# Altium project FlightController.PrjPcb
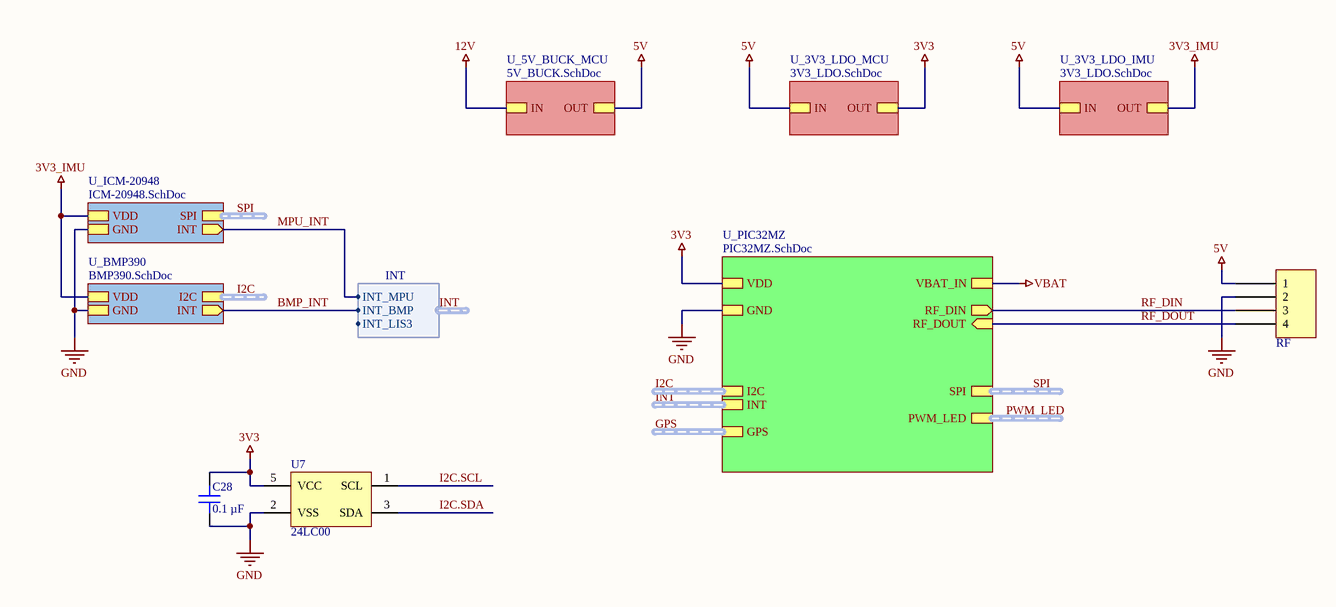
[diagram p0: FlightController.SchDoc]
6 sheets, 42 parts. Net scope: hierarchical (ports join the sheet entries above them; power ports are global).
Board file: FlightController.PcbDoc
Sheets:
  FlightController.SchDoc
    U_PIC32MZ = PIC32MZ.SchDoc
    U_3V3_LDO_MCU = 3V3_LDO.SchDoc
    U_3V3_LDO_IMU = 3V3_LDO.SchDoc
    U_ICM-20948 = ICM-20948.SchDoc
    U_BMP390 = BMP390.SchDoc
    U_5V_BUCK_MCU = 5V_BUCK.SchDoc

## Sheet FlightController.SchDoc
size B; Revision: 6.2; SheetNumber: 1; SheetTotal: 6

### Parts
C28  0.1 µF  [CAP 0402_1005]
RF  SM04B-SRSS-TB(LF)(SN)  [JST SM04B-SRSS-TB]  (value not drawn)
U7  24LC00  [SOT-23-5]

### Sub-sheets
U_3V3_LDO_IMU = 3V3_LDO.SchDoc: OUT, IN
U_3V3_LDO_MCU = 3V3_LDO.SchDoc: OUT, IN
U_5V_BUCK_MCU = 5V_BUCK.SchDoc: OUT, IN
U_BMP390 = BMP390.SchDoc: VDD, GND, I2C (harness I2C), INT (out)
U_ICM-20948 = ICM-20948.SchDoc: VDD, GND, SPI (harness I2C), INT (out)
U_PIC32MZ = PIC32MZ.SchDoc: RF_DIN (out), RF_DOUT (in), GND, VDD, VBAT_IN, I2C (harness I2C), GPS (harness GPS), PWM_LED (harness PWM_LED), INT (harness INT), SPI (harness SPI)

### Harnesses
INT: INT_MPU, INT_BMP, INT_LIS3

### Nets
3V3: C28.2 U7.5(VCC) ; sheet U_PIC32MZ/VDD, sheet U_3V3_LDO_MCU/OUT
3V3_IMU: sheet U_3V3_LDO_IMU/OUT, sheet U_ICM-20948/VDD, sheet U_BMP390/VDD
5V: RF.1 ; sheet U_3V3_LDO_MCU/IN, sheet U_3V3_LDO_IMU/IN, sheet U_5V_BUCK_MCU/OUT
GND: C28.1 RF.2 U7.2(VSS) ; sheet U_PIC32MZ/GND, sheet U_ICM-20948/GND, sheet U_BMP390/GND
BMP_INT: sheet U_BMP390/INT, sheet U_PIC32MZ/INT.INT_BMP
I2C.SCL: U7.1(SCL)
I2C.SDA: U7.3(SDA)
MPU_INT: sheet U_ICM-20948/INT, sheet U_PIC32MZ/INT.INT_MPU  [project net INT.INT_MPU]
RF_DIN: RF.3 ; sheet U_PIC32MZ/RF_DIN
RF_DOUT: RF.4 ; sheet U_PIC32MZ/RF_DOUT

### Buses and harness runs
harness GPS = sheet U_PIC32MZ/GPS
harness I2C = sheet U_BMP390/I2C
harness I2C = sheet U_PIC32MZ/I2C
harness INT = sheet U_PIC32MZ/INT
harness PWM_LED = sheet U_PIC32MZ/PWM_LED
harness SPI = sheet U_ICM-20948/SPI
harness SPI = sheet U_PIC32MZ/SPI

### Library data of the parts
C28 = C0402C104K4RACAUTO: CAP CER 0.1UF 16V X7R 0402; manufacturer: KEMET; Tolerance: ±10%; Part Number: C0402C104K4RACAUTO; Value: 0.1 µF; Applications: Automotive, Bypass, Decoupling; Capacitance: 0.1 µF; componentlink1description: Datasheet; componentlink1url: https://api.kemet.com/component-edge/download/specsheet/C0402C104K4RACAUTO.pdf; componentlink2description: DigiKey Link; componentlink2url: https://www.digikey.com/en/products/detail/kemet/C0402C104K4RACAUTO/3314827; Device Package: 0402 (1005 Metric); lastupdated: 8/14/2022 9:05:51 PM; Lifecycle Status: Active; Minimum Order: 1; Mounting Type: Surface Mount, MLCC; Operating Temperature: -55°C ~ 125°C; Package / Case: 0402 (1005 Metric); packaging: TapeAndReel; partid: 3024; Part Status: Active; price: 0.01; Ratings: AEC-Q200; series: SMD Auto X7R; Size / Dimension: 0.039" L x 0.020" W (1.00mm x 0.50mm); Supplier 1: DigiKey; Supplier Part Number 1: 399-6828-1-ND; Temperature Coefficient: X7R; Thickness (Max): 0.022" (0.55mm); Voltage - Rated: 16V
RF = SM04B-SRSS-TB(LF)(SN): CONN HEADER SMD R/A 4POS 1MM; Manufacturer: JST Sales America Inc.; Current Rating (Amps): 0.7A; Material Flammability Rating: UL94 V-0; Number of Positions: 4; Number of Positions Loaded: All; Pitch - Mating: 0.039" (1.00mm); Shrouding: Shrouded - 4 Wall; Style: Board to Cable/Wire; Voltage Rating: 50V; Part Number: SM04B-SRSS-TB(LF)(SN); ComponentLink1Description: Datasheet; ComponentLink1URL: http://www.jst-mfg.com/product/pdf/eng/eSH.pdf; ComponentLink2Description: DigiKey Link; ComponentLink2URL: http://digikey.com/product-detail/en/jst-sales-america-inc/SM04B-SRSS-TB-LF-SN/455-1804-1-ND/926875; Connector Type: Header; Contact Finish - Mating: Tin; Contact Finish - Post: Tin; Contact Material: Copper Alloy; Contact Shape: Square; Contact Type: Male Pin; Fastening Type: Push-Pull; Features: Solder Retention; Insulation Color: Natural; Insulation Height: 0.114" (2.90mm); Insulation Material: Polyamide (PA), Nylon; LastUpdated: 1/12/2020 11:41:52 PM; Lifecycle Status: Active; Minimum Order: 1; Mounting Type: Surface Mount, Right Angle; Number of Rows: 1; Operating Temperature: -25°C ~ 85°C; Packaging: TapeAndReel; PartId: 62; Part Status: Active; Price: 0.26; Series: SR; Supplier 1: DigiKey; Supplier Part Number 1: 455-1804-1-ND; Termination: Solder
U7 = 24LC00: EEPROM

## Sheet PIC32MZ.SchDoc
size B; SheetNumber: 2; SheetTotal: 6
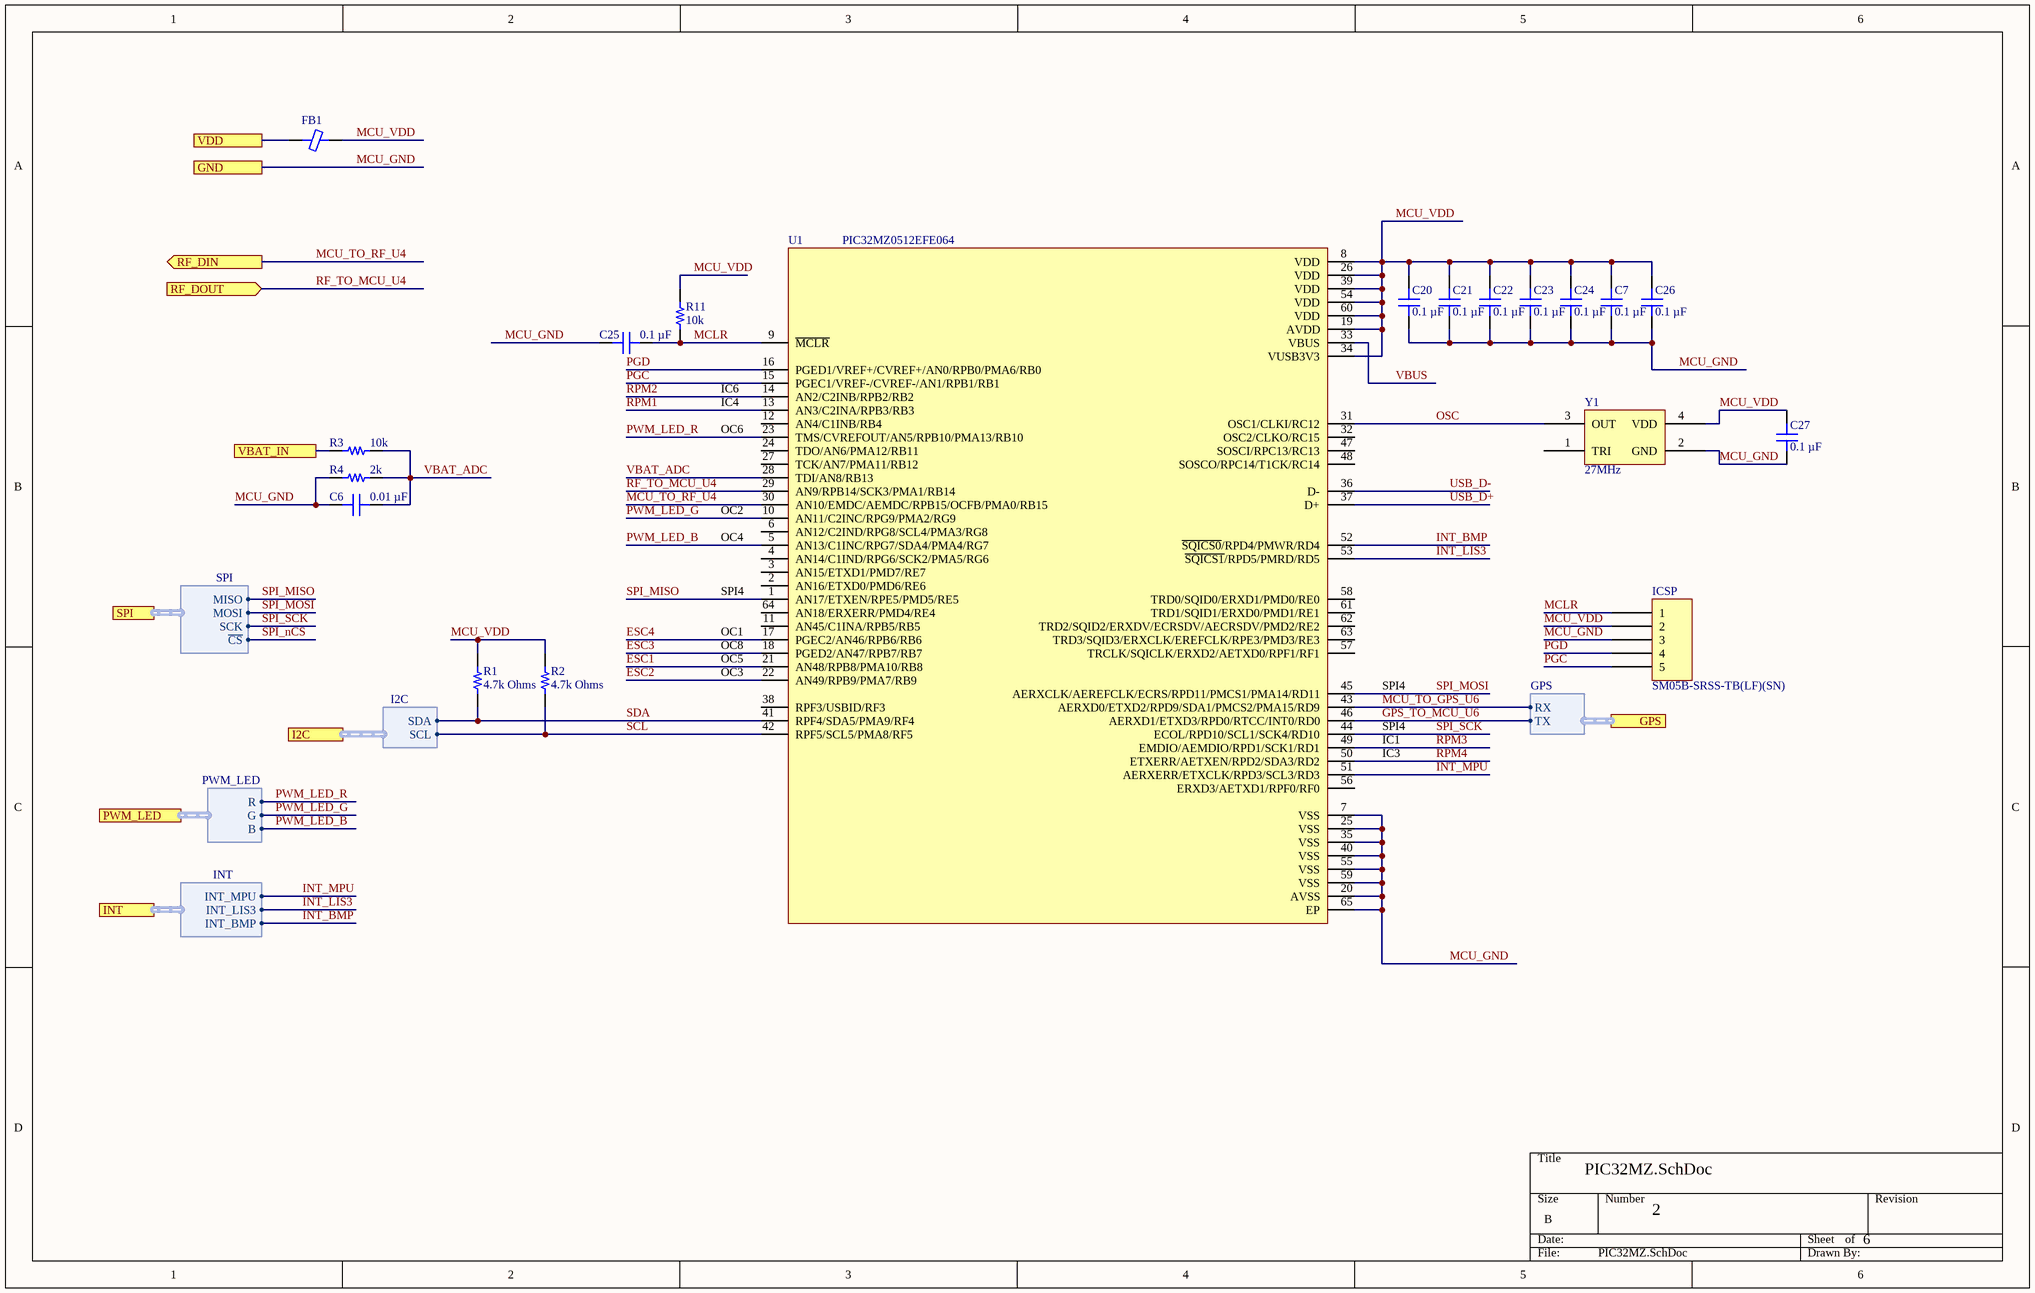
[diagram p1: PIC32MZ.SchDoc]

### Parts
C6  0.01 µF  [CAP 0402_1005]
C7  0.1 µF  [CAP 0402_1005]
C20  0.1 µF  [CAP 0402_1005]
C21  0.1 µF  [CAP 0402_1005]
C22  0.1 µF  [CAP 0402_1005]
C23  0.1 µF  [CAP 0402_1005]
C24  0.1 µF  [CAP 0402_1005]
C25  0.1 µF  [CAP 0402_1005]
C26  0.1 µF  [CAP 0402_1005]
C27  0.1 µF  [CAP 0402_1005]
FB1  (no value)  [FER 0805_2012]
ICSP  SM05B-SRSS-TB(LF)(SN)  [JST SM05B-SRSS-TB]
R1  4.7k Ohms  [RES 0402_1005]
R2  4.7k Ohms  [RES 0402_1005]
R3  10k  [RES 0402_1005]
R4  2k  [RES 0402_1005]
R11  10k  [RES 0402_1005]
U1  PIC32MZ0512EFE064  [QFN50P900X900X100-65N]
Y1  27MHz  [ABRACON ASD]

### Ports
GND, GPS (harness GPS), I2C (harness I2C), INT (harness INT), PWM_LED (harness PWM_LED), RF_DIN (out), RF_DOUT (in), SPI (harness SPI), VBAT_IN, VDD

### Harnesses
I2C: SDA, SCL
SPI: MISO, SCK, MOSI, ~{CS}
GPS: RX, TX
PWM_LED: R, B, G
INT: INT_MPU, INT_BMP, INT_LIS3

### Nets
3V3: FB1.1 ; port VDD
MCU_GND: C6.2 C7.1 C20.1 C21.1 C22.1 C23.1 C24.1 C25.2 C26.1 C27.1 ICSP.3 R4.2 U1.7(VSS) U1.20(AVSS) U1.25(VSS) U1.35(VSS) U1.40(VSS) U1.55(VSS) U1.59(VSS) U1.65(EP) Y1.2(GND) ; port GND  [project net GND]
VBAT: R3.2 ; port VBAT_IN
ESC1: U1.21(AN48/RPB8/PMA10/RB8)
ESC2: U1.22(AN49/RPB9/PMA7/RB9)
ESC3: U1.18(PGED2/AN47/RPB7/RB7)
ESC4: U1.17(PGEC2/AN46/RPB6/RB6)
GPS_TO_MCU_U6: U1.46(AERXD1/ETXD3/RPD0/RTCC/INT0/RD0) ; port GPS.TX  [project net GPS.TX]
INT_BMP: U1.52(~{SQICS0}/RPD4/PMWR/RD4) ; port INT.INT_BMP  [project net BMP_INT]
INT_LIS3: U1.53(~{SQICS1}/RPD5/PMRD/RD5) ; port INT.INT_LIS3  [project net INT.INT_LIS3]
INT_MPU: U1.51(AERXERR/ETXCLK/RPD3/SCL3/RD3) ; port INT.INT_MPU  [project net INT.INT_MPU]
MCLR: C25.1 ICSP.1 R11.1 U1.9(~{MCLR})
MCU_TO_GPS_U6: U1.43(AERXD0/ETXD2/RPD9/SDA1/PMCS2/PMA15/RD9) ; port GPS.RX  [project net GPS.RX]
MCU_TO_RF_U4: U1.30(AN10/EMDC/AEMDC/RPB15/OCFB/PMA0/RB15) ; port RF_DIN  [project net RF_DIN]
MCU_VDD: C7.2 C20.2 C21.2 C22.2 C23.2 C24.2 C26.2 C27.2 FB1.2 ICSP.2 R1.2 R2.2 R11.2 U1.8(VDD) U1.19(AVDD) U1.26(VDD) U1.34(VUSB3V3) U1.39(VDD) U1.54(VDD) U1.60(VDD) Y1.4(VDD)
OSC: U1.31(OSC1/CLKI/RC12) Y1.3(OUT)
PGC: ICSP.5 U1.15(PGEC1/VREF-/CVREF-/AN1/RPB1/RB1)
PGD: ICSP.4 U1.16(PGED1/VREF+/CVREF+/AN0/RPB0/PMA6/RB0)
PWM_LED_B: U1.5(AN13/C1INC/RPG7/SDA4/PMA4/RG7) ; port PWM_LED.B  [project net PWM_LED.B]
PWM_LED_G: U1.10(AN11/C2INC/RPG9/PMA2/RG9) ; port PWM_LED.G  [project net PWM_LED.G]
PWM_LED_R: U1.23(TMS/CVREFOUT/AN5/RPB10/PMA13/RB10) ; port PWM_LED.R  [project net PWM_LED.R]
RF_TO_MCU_U4: U1.29(AN9/RPB14/SCK3/PMA1/RB14) ; port RF_DOUT  [project net RF_DOUT]
RPM1: U1.13(AN3/C2INA/RPB3/RB3)
RPM2: U1.14(AN2/C2INB/RPB2/RB2)
RPM3: U1.49(EMDIO/AEMDIO/RPD1/SCK1/RD1)
RPM4: U1.50(ETXERR/AETXEN/RPD2/SDA3/RD2)
SCL: R2.1 U1.42(RPF5/SCL5/PMA8/RF5) ; port I2C.SCL  [project net I2C.SCL]
SDA: R1.1 U1.41(RPF4/SDA5/PMA9/RF4) ; port I2C.SDA  [project net I2C.SDA]
SPI_MISO: U1.1(AN17/ETXEN/RPE5/PMD5/RE5) ; port SPI.MISO  [project net SPI.MISO]
SPI_MOSI: U1.45(AERXCLK/AEREFCLK/ECRS/RPD11/PMCS1/PMA14/RD11) ; port SPI.MOSI  [project net SPI.MOSI]
SPI_SCK: U1.44(ECOL/RPD10/SCL1/SCK4/RD10) ; port SPI.SCK  [project net SPI.SCK]
USB_D+: U1.37(D+)
USB_D-: U1.36(D-)
VBAT_ADC: C6.1 R3.1 R4.1 U1.28(TDI/AN8/RB13)
VBUS: U1.33(VBUS)

Not connected (* = marked no-connect by the designer): U1 2(AN16/ETXD0/PMD6/RE6) 3(AN15/ETXD1/PMD7/RE7) 4(AN14/C1IND/RPG6/SCK2/PMA5/RG6) 6(AN12/C2IND/RPG8/SCL4/PMA3/RG8) 11(AN45/C1INA/RPB5/RB5) 12(AN4/C1INB/RB4) 24(TDO/AN6/PMA12/RB11) 27(TCK/AN7/PMA11/RB12) 32(OSC2/CLKO/RC15) 38(RPF3/USBID/RF3) 47(SOSCI/RPC13/RC13) 48(SOSCO/RPC14/T1CK/RC14) 56(ERXD3/AETXD1/RPF0/RF0) 57(TRCLK/SQICLK/ERXD2/AETXD0/RPF1/RF1) 58(TRD0/SQID0/ERXD1/PMD0/RE0) 61(TRD1/SQID1/ERXD0/PMD1/RE1) 62(TRD2/SQID2/ERXDV/ECRSDV/AECRSDV/PMD2/RE2) 63(TRD3/SQID3/ERXCLK/EREFCLK/RPE3/PMD3/RE3) 64(AN18/ERXERR/PMD4/RE4); Y1 1(TRI)

### Notes on the sheet
- (near U1) IC4
- IC6
- (near U1) OC6
- (near U1) OC2
- (near U1) OC4
- (near U1) OC1
- (near U1) SPI4
- (near U1) OC5
- (near U1) OC3
- (near U1) OC8
- SPI4
- IC1
- IC3

### Library data of the parts
C6 = C0402C104K4RACAUTO: CAP CER 0.1UF 16V X7R 0402; manufacturer: KEMET; Capacitance: 0.1 µF; Tolerance: ±10%; Part Number: C0402C104K4RACAUTO; Value: 0.01 µF; Applications: Automotive, Bypass, Decoupling; componentlink1description: Datasheet; componentlink1url: https://api.kemet.com/component-edge/download/specsheet/C0402C104K4RACAUTO.pdf; componentlink2description: DigiKey Link; componentlink2url: https://www.digikey.com/en/products/detail/kemet/C0402C104K4RACAUTO/3314827; Device Package: 0402 (1005 Metric); lastupdated: 8/14/2022 9:05:51 PM; Lifecycle Status: Active; Minimum Order: 1; Mounting Type: Surface Mount, MLCC; Operating Temperature: -55°C ~ 125°C; Package / Case: 0402 (1005 Metric); packaging: TapeAndReel; partid: 3024; Part Status: Active; price: 0.01; Ratings: AEC-Q200; series: SMD Auto X7R; Size / Dimension: 0.039" L x 0.020" W (1.00mm x 0.50mm); Supplier 1: DigiKey; Supplier Part Number 1: 399-6828-1-ND; Temperature Coefficient: X7R; Thickness (Max): 0.022" (0.55mm); Voltage - Rated: 16V
C7 C20-C27 = C0402C104K4RACAUTO: as C28 on sheet FlightController; Part Number: C0402C104K4RACAUTO; Value: 0.1 µF; Applications: Automotive, Bypass, Decoupling; Capacitance: 0.1 µF; componentlink1description: Datasheet; componentlink1url: https://api.kemet.com/component-edge/download/specsheet/C0402C104K4RACAUTO.pdf; componentlink2description: DigiKey Link; componentlink2url: https://www.digikey.com/en/products/detail/kemet/C0402C104K4RACAUTO/3314827; Device Package: 0402 (1005 Metric); lastupdated: 8/14/2022 9:05:51 PM; Lifecycle Status: Active; Minimum Order: 1; Mounting Type: Surface Mount, MLCC; Operating Temperature: -55°C ~ 125°C; Package / Case: 0402 (1005 Metric); packaging: TapeAndReel; partid: 3024; Part Status: Active; price: 0.01; Ratings: AEC-Q200; series: SMD Auto X7R; Size / Dimension: 0.039" L x 0.020" W (1.00mm x 0.50mm); Supplier 1: DigiKey; Supplier Part Number 1: 399-6828-1-ND; Temperature Coefficient: X7R; Thickness (Max): 0.022" (0.55mm); Voltage - Rated: 16V
FB1 = 2508051017Y0: FERRITE BEAD 0805 1LN; Manufacturer: Fair-Rite Products Corp.; Current Rating (Max): 300mA; DC Resistance (DCR) (Max): 200mOhm; Filter Type: Signal Line; Number of Lines: 1; Part Number: 2508051017Y0; ComponentLink1Description: Datasheet; ComponentLink1URL: http://www.fair-rite.com/wp-content/themes/fair-rite/print_product.php?pid=19091; ComponentLink2Description: DigiKey Link; ComponentLink2URL: http://digikey.com/product-detail/en/fair-rite-products-corp/2508051017Y0/1934-1435-1-ND/8594382; Device Package: 0805 (2012 Metric); Height (Max): 0.043" (1.10mm); LastUpdated: 9/2/2020 1:18:22 AM; Lifecycle Status: Active; Minimum Order: 1; Mounting Type: Surface Mount; Operating Temperature: -55°C ~ 125°C; Package / Case: 0805 (2012 Metric); Packaging: TapeAndReel; PartId: 1308; Part Status: Active; Price: 0.02; Series: -; Size / Dimension: 0.079" L x 0.049" W (2.00mm x 1.25mm); Supplier 1: DigiKey; Supplier Part Number 1: 1934-1435-1-ND
ICSP = SM05B-SRSS-TB(LF)(SN): CONN HEADER SMD R/A 5POS 1MM; Manufacturer: JST Sales America Inc.; Current Rating (Amps): 0.7A; Material Flammability Rating: UL94 V-0; Number of Positions: 5; Number of Positions Loaded: All; Pitch - Mating: 0.039" (1.00mm); Shrouding: Shrouded - 4 Wall; Style: Board to Cable/Wire; Voltage Rating: 50V; Part Number: SM05B-SRSS-TB(LF)(SN); ComponentLink1Description: Datasheet; ComponentLink1URL: http://www.jst-mfg.com/product/pdf/eng/eSH.pdf; ComponentLink2Description: DigiKey Link; ComponentLink2URL: http://digikey.com/product-detail/en/jst-sales-america-inc/SM05B-SRSS-TB-LF-SN/455-1805-1-ND/926876; Connector Type: Header; Contact Finish - Mating: Tin; Contact Finish - Post: Tin; Contact Material: Copper Alloy; Contact Shape: Square; Contact Type: Male Pin; Fastening Type: Push-Pull; Features: Solder Retention; Insulation Color: Natural; Insulation Height: 0.114" (2.90mm); Insulation Material: Polyamide (PA), Nylon; LastUpdated: 1/12/2020 11:42:04 PM; Lifecycle Status: Active; Minimum Order: 1; Mounting Type: Surface Mount, Right Angle; Number of Rows: 1; Operating Temperature: -25°C ~ 85°C; Packaging: TapeAndReel; PartId: 63; Part Status: Active; Price: 0.32; Series: SR; Supplier 1: DigiKey; Supplier Part Number 1: 455-1805-1-ND; Termination: Solder
R1-R4 R11 = CRCW0402330RJNEDC: RES 330 OHM 5% 1/16W 0402; Manufacturer: Vishay Dale; Power (Watts): 0.063W, 1/16W; Resistance: 330 Ohms; Temperature Coefficient: ±200ppm/°C; Part Number: CRCW0402330RJNEDC; ComponentLink1Description: Datasheet; ComponentLink1URL: http://www.vishay.com/docs/28773/crcwce3.pdf; ComponentLink2Description: DigiKey Link; ComponentLink2URL: https://www.digikey.com/en/products/detail/vishay-dale/CRCW0402330RJNEDC/7928545; Composition: Thick Film; Device Package: 0402 (1005 Metric); Height - Seated (Max): 0.014" (0.35mm); LastUpdated: 8/14/2022 9:23:31 PM; Lifecycle Status: Active; Minimum Order: 1; Number of Terminations: 2; Operating Temperature: -55°C ~ 155°C; Package / Case: 0402 (1005 Metric); Packaging: CutTape; PartId: 15989; Part Status: Active; Price: 0.01; Series: CRCW-C; Size / Dimension: 0.039" L x 0.020" W (1.00mm x 0.50mm); Supplier 1: DigiKey; Supplier Part Number 1: 541-4123-1-ND; Supplier Device Package: 0402; Tolerance: ±5%
  R1 R2: Value: 4.7k Ohms
  R3 R11: Value: 10k
  R4: Value: 2k
U1 = PIC32MZ0512EFE064-I/PT: 32-bit Microcontrollers - MCU 32-BIT MCU 512KB FL 128KB RAM, No Crypto; MF: Microchip; MP: PIC32MZ2048EFG064T-I/PT; Price: None; Value: *; SnapEDA_Link: https://www.snapeda.com/parts/PIC32MZ2048EFG064T-I/PT/Microchip/view-part/565997/?ref=snap; Package: TQFP-64 Microchip; Availability: Unavailable
Y1 = ASD3-27.000MHZ-EC-T: XTAL OSC XO 27.0000MHZ HCMOS SMD; Manufacturer: Abracon LLC; Base Resonator: Crystal; Current - Supply (Max): 4mA; Frequency Stability: ±50ppm; Function: Enable/Disable; Voltage - Supply: 1.8V; Part Number: ASD3-27.000MHZ-EC-T; ComponentLink1Description: Datasheet; ComponentLink1URL: https://abracon.com/Oscillators/ASDseries.pdf; ComponentLink2Description: DigiKey Link; ComponentLink2URL: http://digikey.com/product-detail/en/abracon-llc/ASD3-27.000MHZ-EC-T/535-9608-1-ND/1237075; Frequency: 27MHz; Height - Seated (Max): 0.039" (1.00mm); LastUpdated: 9/14/2022 8:37:45 AM; Lifecycle Status: Active; Minimum Order: 1; Mounting Type: Surface Mount; Operating Temperature: -20°C ~ 70°C; Output: HCMOS; Package / Case: 4-SMD, No Lead; Packaging: TapeAndReel; PartId: 4; Part Status: Active; Price: 1.74; Series: ASD; Size / Dimension: 0.098" L x 0.079" W (2.50mm x 2.00mm); Supplier 1: DigiKey; Supplier Part Number 1: 535-9608-1-ND; Type: XO (Standard); Value: 27MHz

## Sheet 3V3_LDO.SchDoc
size A; SheetNumber: 3; SheetTotal: 6
Used 2 times, as channels U_3V3_LDO_MCU, U_3V3_LDO_IMU. Parts and nets are listed once, with the designators drawn on the sheet.
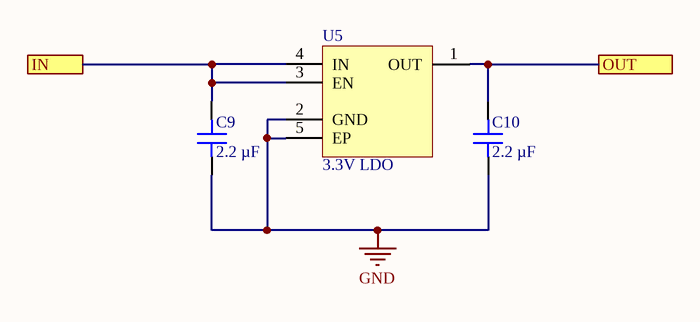
[diagram p2: 3V3_LDO.SchDoc]

### Parts
C9  2.2 µF  [CAP 0402_1005]
C10  2.2 µF  [CAP 0402_1005]
U5  3.3V LDO  [XDFN-4]

### Ports
IN, OUT

### Nets
GND: C9.1 C10.1 U5.2(GND) U5.5(EP)
IN: C9.2 U5.3(EN) U5.4(IN) ; port IN
OUT: C10.2 U5.1(OUT) ; port OUT

### Channels
U_3V3_LDO_MCU: designators end in _2; ports IN=5V OUT=3V3
U_3V3_LDO_IMU: designators end in _1; ports IN=5V OUT=3V3_IMU

### Library data of the parts
C9 C10 = C0402C104K4RACAUTO: as C6 on sheet PIC32MZ; Part Number: C0402C104K4RACAUTO; Value: 2.2 µF; Applications: Automotive, Bypass, Decoupling; componentlink1description: Datasheet; componentlink1url: https://api.kemet.com/component-edge/download/specsheet/C0402C104K4RACAUTO.pdf; componentlink2description: DigiKey Link; componentlink2url: https://www.digikey.com/en/products/detail/kemet/C0402C104K4RACAUTO/3314827; Device Package: 0402 (1005 Metric); lastupdated: 8/14/2022 9:05:51 PM; Lifecycle Status: Active; Minimum Order: 1; Mounting Type: Surface Mount, MLCC; Operating Temperature: -55°C ~ 125°C; Package / Case: 0402 (1005 Metric); packaging: TapeAndReel; partid: 3024; Part Status: Active; price: 0.01; Ratings: AEC-Q200; series: SMD Auto X7R; Size / Dimension: 0.039" L x 0.020" W (1.00mm x 0.50mm); Supplier 1: DigiKey; Supplier Part Number 1: 399-6828-1-ND; Temperature Coefficient: X7R; Thickness (Max): 0.022" (0.55mm); Voltage - Rated: 16V
U5 = TLV74033PDQNR

## Sheet ICM-20948.SchDoc
size A; SheetNumber: 6; SheetTotal: 6
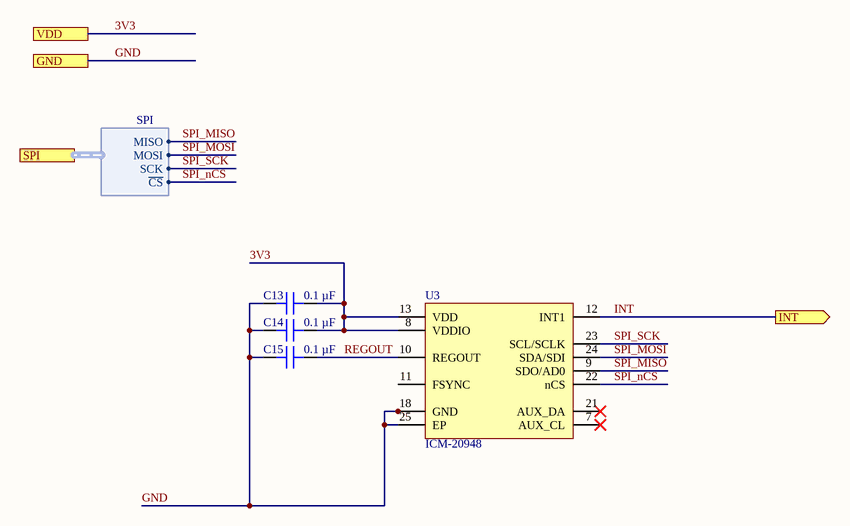
[diagram p3: ICM-20948.SchDoc]

### Parts
C13  0.1 µF  [CAP 0402_1005]
C14  0.1 µF  [CAP 0402_1005]
C15  0.1 µF  [CAP 0402_1005]
U3  ICM-20948  [ICM-20948]

### Ports
GND, INT (out), SPI (harness SPI), VDD

### Harnesses
SPI: MISO, SCK, MOSI, ~{CS}

### Nets
3V3: C13.1 C14.1 U3.8(VDDIO) U3.13(VDD) ; port VDD  [project net 3V3_IMU]
GND: C13.2 C14.2 C15.2 U3.18(GND) U3.20(GND) U3.25(EP) ; port GND
INT: U3.12(INT1) ; port INT  [project net INT.INT_MPU]
REGOUT: C15.1 U3.10(REGOUT)
SPI_MISO: U3.9(SDO/AD0) ; port SPI.MISO  [project net SPI.MISO]
SPI_MOSI: U3.24(SDA/SDI) ; port SPI.MOSI  [project net SPI.MOSI]
SPI_nCS: U3.22(nCS) ; port SPI.~{CS}  [project net SPI.~{CS}]
SPI_SCK: U3.23(SCL/SCLK) ; port SPI.SCK  [project net SPI.SCK]

Not connected (* = marked no-connect by the designer): U3 7(AUX_CL)* 11(FSYNC) 21(AUX_DA)*

### Library data of the parts
C13-C15 = C0402C104K4RACAUTO: as C28 on sheet FlightController; Part Number: C0402C104K4RACAUTO; Value: 0.1 µF; Applications: Automotive, Bypass, Decoupling; Capacitance: 0.1 µF; componentlink1description: Datasheet; componentlink1url: https://api.kemet.com/component-edge/download/specsheet/C0402C104K4RACAUTO.pdf; componentlink2description: DigiKey Link; componentlink2url: https://www.digikey.com/en/products/detail/kemet/C0402C104K4RACAUTO/3314827; Device Package: 0402 (1005 Metric); lastupdated: 8/14/2022 9:05:51 PM; Lifecycle Status: Active; Minimum Order: 1; Mounting Type: Surface Mount, MLCC; Operating Temperature: -55°C ~ 125°C; Package / Case: 0402 (1005 Metric); packaging: TapeAndReel; partid: 3024; Part Status: Active; price: 0.01; Ratings: AEC-Q200; series: SMD Auto X7R; Size / Dimension: 0.039" L x 0.020" W (1.00mm x 0.50mm); Supplier 1: DigiKey; Supplier Part Number 1: 399-6828-1-ND; Temperature Coefficient: X7R; Thickness (Max): 0.022" (0.55mm); Voltage - Rated: 16V
U3 = ICM-20948: 9-DOF IMU

## Sheet BMP390.SchDoc
size A; SheetNumber: 6; SheetTotal: 7
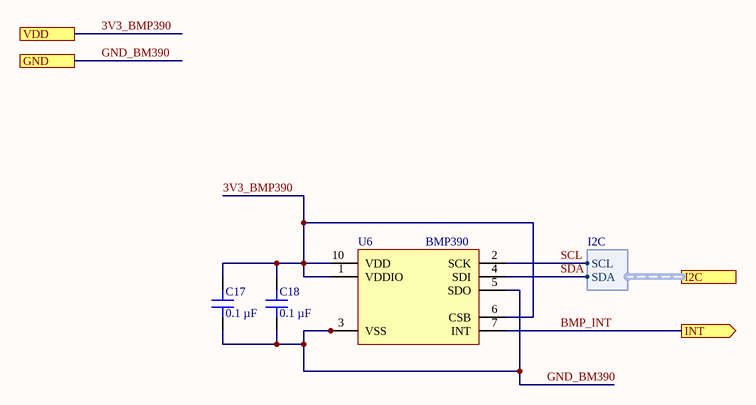
[diagram p4: BMP390.SchDoc]

### Parts
C17  0.1 µF  [CAP 0402_1005]
C18  0.1 µF  [CAP 0402_1005]
U6  BMP390  [BMP390L]

### Ports
GND, I2C (harness I2C), INT (out), VDD

### Harnesses
I2C: SCL, SDA

### Nets
3V3_BMP390: C17.2 C18.2 U6.1(VDDIO) U6.6(CSB) U6.10(VDD) ; port VDD  [project net 3V3_IMU]
GND_BM390: C17.1 C18.1 U6.3(VSS) U6.5(SDO) U6.8(VSS) U6.9(VSS) ; port GND  [project net GND]
BMP_INT: U6.7(INT) ; port INT
SCL: U6.2(SCK) ; port I2C.SCL  [project net I2C.SCL]
SDA: U6.4(SDI) ; port I2C.SDA  [project net I2C.SDA]

### Library data of the parts
C17 C18 = C0402C104K4RACAUTO: as C28 on sheet FlightController; Part Number: C0402C104K4RACAUTO; Value: 0.1 µF; Applications: Automotive, Bypass, Decoupling; Capacitance: 0.1 µF; componentlink1description: Datasheet; componentlink1url: https://api.kemet.com/component-edge/download/specsheet/C0402C104K4RACAUTO.pdf; componentlink2description: DigiKey Link; componentlink2url: https://www.digikey.com/en/products/detail/kemet/C0402C104K4RACAUTO/3314827; Device Package: 0402 (1005 Metric); lastupdated: 8/14/2022 9:05:51 PM; Lifecycle Status: Active; Minimum Order: 1; Mounting Type: Surface Mount, MLCC; Operating Temperature: -55°C ~ 125°C; Package / Case: 0402 (1005 Metric); packaging: TapeAndReel; partid: 3024; Part Status: Active; price: 0.01; Ratings: AEC-Q200; series: SMD Auto X7R; Size / Dimension: 0.039" L x 0.020" W (1.00mm x 0.50mm); Supplier 1: DigiKey; Supplier Part Number 1: 399-6828-1-ND; Temperature Coefficient: X7R; Thickness (Max): 0.022" (0.55mm); Voltage - Rated: 16V
U6 = BMP390: Altimeter

## Sheet 5V_BUCK.SchDoc
size A; SheetNumber: 4; SheetTotal: 6
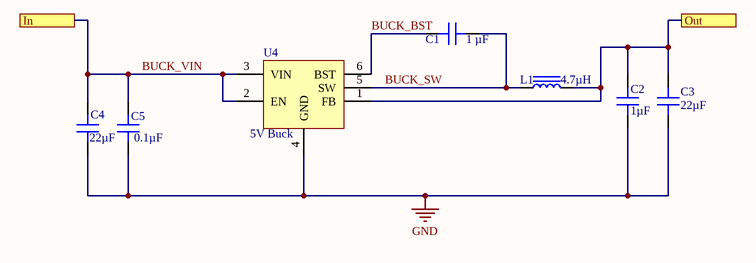
[diagram p5: 5V_BUCK.SchDoc]

### Parts
C1  1 µF  [CAP 0402_1005]
C2  1µF  [CAP 0603_1608]
C3  22µF  [CAP 0805_2012]
C4  22µF  [CAP 0805_2012]
C5  0.1µF  [CAP 0603_1608]
L1  4.7µH  [IND 1008_2520]
U4  5V Buck  [TSOT-26-6 - 3.2mm]

### Ports
In, Out

### Nets
5V: C2.2 C3.2 L1.2 U4.1(FB) ; port Out
BUCK_VIN: C4.2 C5.1 U4.2(EN) U4.3(VIN) ; port In  [project net 12V]
GND: C2.1 C3.1 C4.1 C5.2 U4.4(GND)
BUCK_BST: C1.1 U4.6(BST)
BUCK_SW: C1.2 L1.1 U4.5(SW)

### Library data of the parts
C1 = C0402C104K4RACAUTO: as C6 on sheet PIC32MZ; Part Number: C0402C104K4RACAUTO; Value: 1 µF; Applications: Automotive, Bypass, Decoupling; componentlink1description: Datasheet; componentlink1url: https://api.kemet.com/component-edge/download/specsheet/C0402C104K4RACAUTO.pdf; componentlink2description: DigiKey Link; componentlink2url: https://www.digikey.com/en/products/detail/kemet/C0402C104K4RACAUTO/3314827; Device Package: 0402 (1005 Metric); lastupdated: 8/14/2022 9:05:51 PM; Lifecycle Status: Active; Minimum Order: 1; Mounting Type: Surface Mount, MLCC; Operating Temperature: -55°C ~ 125°C; Package / Case: 0402 (1005 Metric); packaging: TapeAndReel; partid: 3024; Part Status: Active; price: 0.01; Ratings: AEC-Q200; series: SMD Auto X7R; Size / Dimension: 0.039" L x 0.020" W (1.00mm x 0.50mm); Supplier 1: DigiKey; Supplier Part Number 1: 399-6828-1-ND; Temperature Coefficient: X7R; Thickness (Max): 0.022" (0.55mm); Voltage - Rated: 16V
C2 = GCJ188R71E105KA01D: CAP CER 1UF 25V X7R 0603; Manufacturer: Murata Electronics; Tolerance: ±10%; Part Number: GCJ188R71E105KA01D; Value: 1µF; Applications: Automotive, Boardflex Sensitive; Capacitance: 1µF; ComponentLink1Description: Datasheet; ComponentLink1URL: https://search.murata.co.jp/Ceramy/image/img/A01X/G101/ENG/GCJ188R71E105KA01-01.pdf; ComponentLink2Description: DigiKey Link; ComponentLink2URL: http://digikey.com/product-detail/en/murata-electronics/GCJ188R71E105KA01D/490-14409-1-ND/6606870; Device Package: 0603 (1608 Metric); Features: Soft Termination; LastUpdated: 13-Aug-20 10:24:06 AM; Lifecycle Status: Active; Minimum Order: 1; Mounting Type: Surface Mount, MLCC; Operating Temperature: -55°C ~ 125°C; Package / Case: 0603 (1608 Metric); Packaging: TapeAndReel; PartId: 9566; Part Status: Active; Price: 0.05; Ratings: AEC-Q200; Series: GCJ; Size / Dimension: 0.063" L x 0.031" W (1.60mm x 0.80mm); Supplier 1: DigiKey; Supplier Part Number 1: 490-14409-1-ND; Temperature Coefficient: X7R; Thickness (Max): 0.035" (0.90mm)
C3 = CL21A226MOQNNNE: CAP CER 22UF 16V X5R 0805; Manufacturer: Samsung Electro-Mechanics; Tolerance: ±20%; Part Number: CL21A226MOQNNNE; Value: 22µF; Applications: General Purpose; Capacitance: 22µF; ComponentLink1Description: Datasheet; ComponentLink1URL: http://www.samsungsem.com/kr/support/product-search/mlcc/CL21A226MOQNNNE.jsp; ComponentLink2Description: DigiKey Link; ComponentLink2URL: http://digikey.com/product-detail/en/samsung-electro-mechanics/CL21A226MOQNNNE/1276-2909-1-ND/3890995; Device Package: 0805 (2012 Metric); LastUpdated: 21-Jan-20 12:03:05 AM; Lifecycle Status: Active; Minimum Order: 1; Mounting Type: Surface Mount, MLCC; Operating Temperature: -55°C ~ 85°C; Package / Case: 0805 (2012 Metric); Packaging: TapeAndReel; PartId: 3052; Part Status: Active; Price: 0.11; Series: CL; Size / Dimension: 0.079" L x 0.049" W (2.00mm x 1.25mm); Supplier 1: DigiKey; Supplier Part Number 1: 1276-2909-1-ND; Temperature Coefficient: X5R; Thickness (Max): 0.055" (1.40mm); Voltage - Rated: 16V
C4 = C2012X7S1E106K125AC: CAP CER 10UF 25V X7S 0805; Manufacturer: TDK Corporation; Capacitance: 10µF; Tolerance: ±10%; Part Number: C2012X7S1E106K125AC; Value: 22µF; Applications: General Purpose; ComponentLink1Description: Datasheet; ComponentLink1URL: https://product.tdk.com/en/search/capacitor/ceramic/mlcc/info?part_no=C2012X7S1E106K125AC?ref_disty=digikey; ComponentLink2Description: DigiKey Link; ComponentLink2URL: http://digikey.com/product-detail/en/tdk-corporation/C2012X7S1E106K125AC/445-181600-1-ND/9991478; Device Package: 0805 (2012 Metric); Features: Low ESL; LastUpdated: 21-Jan-20 12:03:04 AM; Lifecycle Status: Active; Minimum Order: 1; Mounting Type: Surface Mount, MLCC; Operating Temperature: -55°C ~ 125°C; Package / Case: 0805 (2012 Metric); Packaging: TapeAndReel; PartId: 3339; Part Status: Active; Price: 0.15; Series: C; Size / Dimension: 0.079" L x 0.049" W (2.00mm x 1.25mm); Supplier 1: DigiKey; Supplier Part Number 1: 445-181600-1-ND; Temperature Coefficient: X7S; Thickness (Max): 0.057" (1.45mm); Voltage - Rated: 25V
C5 = GCG188R92A104KA03D: CAP CER 0.1UF 100V 0603 EPOXY; Manufacturer: Murata Electronics; Temperature Coefficient: X8R; Tolerance: ±10%; Part Number: GCG188R92A104KA03D; Value: 0.1µF; Applications: Automotive; Capacitance: 0.1µF; ComponentLink1Description: Datasheet; ComponentLink1URL: https://search.murata.co.jp/Ceramy/image/img/A01X/G101/ENG/GCG188R92A104KA03-01.pdf; ComponentLink2Description: DigiKey Link; ComponentLink2URL: http://digikey.com/product-detail/en/murata-electronics/GCG188R92A104KA03D/490-18197-1-ND/9867926; Device Package: 0603 (1608 Metric); Features: Epoxy Mountable; LastUpdated: 21-Jan-20 12:01:59 AM; Lifecycle Status: Active; Minimum Order: 1; Mounting Type: Surface Mount, MLCC, Epoxy; Operating Temperature: -55°C ~ 150°C; Package / Case: 0603 (1608 Metric); Packaging: TapeAndReel; PartId: 9025; Part Status: Active; Price: 0.07; Ratings: AEC-Q200; Series: GCG; Size / Dimension: 0.063" L x 0.031" W (1.60mm x 0.80mm); Supplier 1: DigiKey; Supplier Part Number 1: 490-18197-1-ND; Thickness (Max): 0.035" (0.90mm); Voltage - Rated: 100V
L1 = MLP2520S4R7ST0S1: FIXED IND 4.7UH 1A 110 MOHM SMD; Manufacturer: TDK Corporation; DC Resistance (DCR): 143mOhm Max; Inductance Frequency - Test: 2MHz; Material - Core: Ferrite; Shielding: Shielded; Tolerance: ±20%; Type: Multilayer; Part Number: MLP2520S4R7ST0S1; ComponentLink1Description: Datasheet; ComponentLink1URL: https://product.tdk.com/info/en/catalog/datasheets/inductor_commercial_power_mlp2520_en.pdf?ref_disty=digikey; ComponentLink2Description: DigiKey Link; ComponentLink2URL: http://digikey.com/product-detail/en/tdk-corporation/MLP2520S4R7ST0S1/445-6378-1-ND/2465705; Current Rating (Amps): 1A; Device Package: 1008 (2520 Metric); Height - Seated (Max): 0.039" (1.00mm); Inductance: 4.7µH; LastUpdated: 13-Aug-20 11:03:40 AM; Lifecycle Status: Active; Minimum Order: 1; Mounting Type: Surface Mount; Operating Temperature: -40°C ~ 125°C; Package / Case: 1008 (2520 Metric); Packaging: TapeAndReel; PartId: 3467; Part Status: Active; Price: 0.14; Series: MLP; Size / Dimension: 0.098" L x 0.079" W (2.50mm x 2.00mm); Supplier 1: DigiKey; Supplier Part Number 1: 445-6378-1-ND; Supplier Device Package: 1008 (2520 Metric); Value: 4.7µH
U4 = AP63205WU-7: 5V fixed step down Buck

## Nets that join several sheets
3V3: FlightController (C28.2 U7.5), PIC32MZ (FB1.1), U_3V3_LDO_MCU (C10_2.2 U5_2.1)
3V3_IMU: U_3V3_LDO_IMU (C10_1.2 U5_1.1), ICM-20948 (C13.1 C14.1 U3.8 U3.13), BMP390 (5 pins)
5V: FlightController (RF.1), U_3V3_LDO_MCU (C9_2.2 U5_2.3 U5_2.4), U_3V3_LDO_IMU (C9_1.2 U5_1.3 U5_1.4), 5V_BUCK (C2.2 C3.2 L1.2 U4.1)
GND: FlightController (C28.1 RF.2 U7.2), PIC32MZ (21 pins), U_3V3_LDO_MCU (C9_2.1 C10_2.1 U5_2.2 U5_2.5), U_3V3_LDO_IMU (C9_1.1 C10_1.1 U5_1.2 U5_1.5), ICM-20948 (6 pins), BMP390 (6 pins), 5V_BUCK (5 pins)
BMP_INT: PIC32MZ (U1.52), BMP390 (U6.7)
I2C.SCL: PIC32MZ (R2.1 U1.42), BMP390 (U6.2)
I2C.SDA: PIC32MZ (R1.1 U1.41), BMP390 (U6.4)
INT.INT_MPU: PIC32MZ (U1.51), ICM-20948 (U3.12)
RF_DIN: FlightController (RF.3), PIC32MZ (U1.30)
RF_DOUT: FlightController (RF.4), PIC32MZ (U1.29)
SPI.MISO: PIC32MZ (U1.1), ICM-20948 (U3.9)
SPI.MOSI: PIC32MZ (U1.45), ICM-20948 (U3.24)
SPI.SCK: PIC32MZ (U1.44), ICM-20948 (U3.23)

## Assembly variants
Main: all parts fitted